# EAGLE schematic Nav Switch v1 (EAGLE 6.5.0)
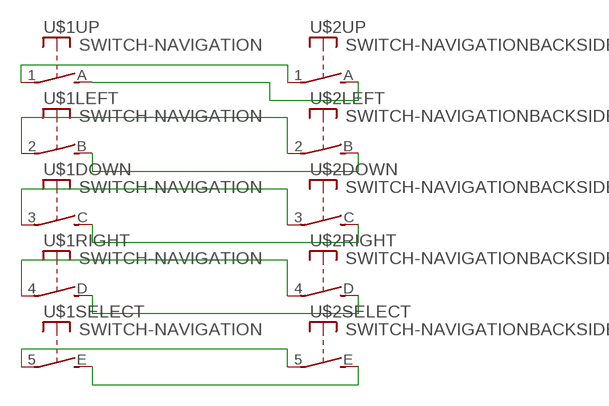
[diagram p0: schematic, sheet 1]

## Parts
U$1  SWITCH-NAVIGATION  [JOYSTICK-NOKIA-3230]
U$2  SWITCH-NAVIGATIONBACKSIDE  [JOYSTICK-NOKIA-3230(BACKSIDE)]

## Nets
N$1: U$1.A(UP:S) U$2.A(UP:S)
N$2: U$1.1(UP:P) U$2.1(UP:P)
N$3: U$1.B(LEFT:S) U$2.B(LEFT:S)
N$4: U$1.2(LEFT:P) U$2.2(LEFT:P)
N$5: U$1.C(DOWN:S) U$2.C(DOWN:S)
N$6: U$1.3(DOWN:P) U$2.3(DOWN:P)
N$7: U$1.D(RIGHT:S) U$2.D(RIGHT:S)
N$8: U$1.4(RIGHT:P) U$2.4(RIGHT:P)
N$9: U$1.E(SELECT:S) U$2.E(SELECT:S)
N$10: U$1.5(SELECT:P) U$2.5(SELECT:P)

## Library data of the parts
U$1 U$2 = Jianan Li:SWITCH-NAVIGATION